# EAGLE design Usb breakout (EAGLE 6.6.0)
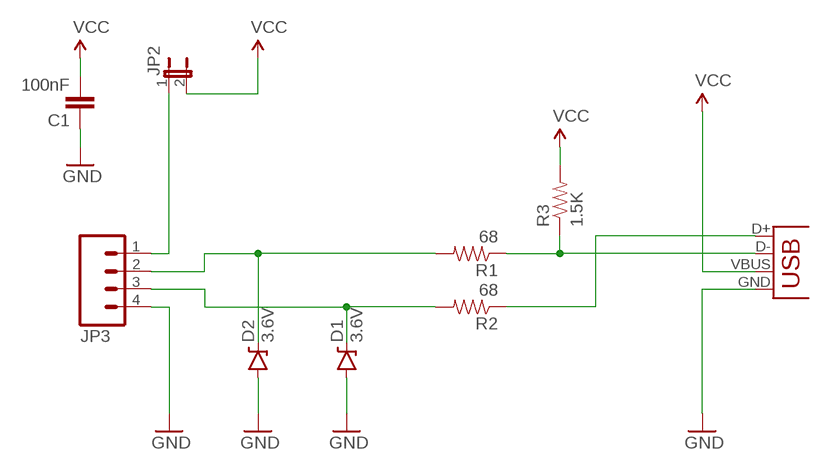
[diagram p0: schematic, sheet 1]

## Parts
C1  100nF  CAPEZ  [CAP-PTH-SMALLEZ]
D1  3.6V  DIODE-ZENERPTH  [DIODE-ZENER]
D2  3.6V  DIODE-ZENERPTH  [DIODE-ZENER]
JP1  USB-B  USBPTH  [USB-B-PTH]
JP2  JUMPER-2-OLDPTH  [1X02]
JP3  M04PTH  [1X04]
R1  68  RESISTORPTH-1/4W  [AXIAL-0.4]
R2  68  RESISTORPTH-1/4W  [AXIAL-0.4]
R3  1.5K  RESISTORPTH-1/4W  [AXIAL-0.4]

## Nets
GND: C1.1 D1.P$2(A) D2.P$2(A) JP1.GND JP3.4
N$1: JP1.D- R1.P$1 R3.P$1
N$2: D2.P$1(C) JP3.2 R1.P$2
N$3: D1.P$1(C) JP3.3 R2.P$2
N$4: JP1.D+ R2.P$1
N$5: JP2.1 JP3.1
VCC: C1.2 JP1.VBUS JP2.2 R3.P$2

## Library data of the parts
C1 = SparkFun-Passives:CAP: Capacitor Standard 0603 ceramic capacitor, and 0.1" leaded capacitor.
D1 D2 = SparkFun-DiscreteSemi:DIODE-ZENER: Zener Diode Production Part - 8199 3.4V Zener Voltage
JP1 = SparkFun-Connectors:USB: USB Connectors USB-B-PTH is fully proven SKU : PRT-00139/CONN-08278 USB-miniB is fully proven SKU : PRT-00587 USB-A-PCB is untested. USB-A-H is throughly reviewed, but untested. Spark Fun Electronics SKU : PRT-00437 USB-B-SMT is throughly reviewed, but untested. Needs silkscreen touching up. USB-A-S has not been used/tested USB-MB-H has not been used/tested USB-MICROB has been used. CONN-09505; PROD_ID: CONN-08278
JP2 = SparkFun-Retired:JUMPER-2-OLD: Jumper Basic 0.1" spaced jumper. Use with breakaway headers.
JP3 = SparkFun-Connectors:M04: Header 4 Standard 4-pin 0.1" header. Use with straight break away headers (SKU : PRT-00116), right angle break away headers (PRT-00553), swiss pins (PRT-00743), machine pins (PRT-00117), and female headers (PRT-00115). Molex polarized connector foot print use with SKU : PRT-08231 with associated crimp pins and housings. 1MM SMD Version SKU: PRT-10208
R1-R3 = SparkFun-Passives:RESISTOR: Resistor Basic schematic elements and footprints for 0603, 1206, and PTH resistors.

## Board
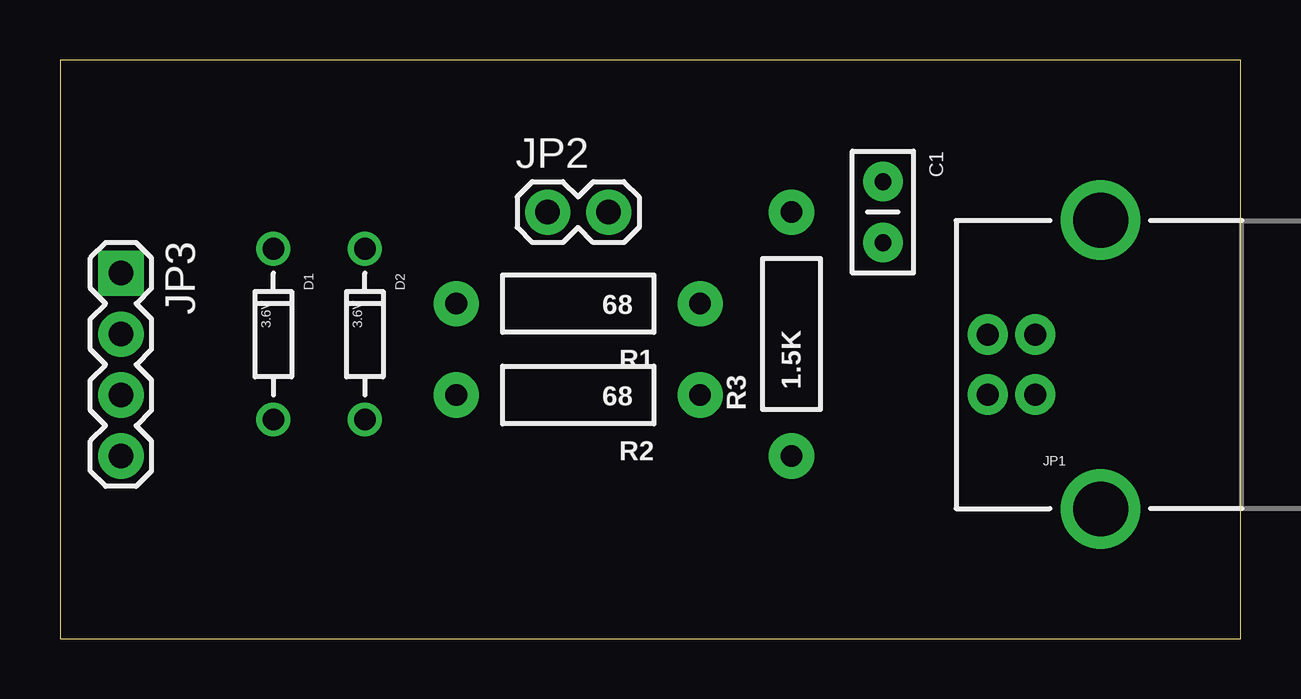
[diagram p1: board, top side]
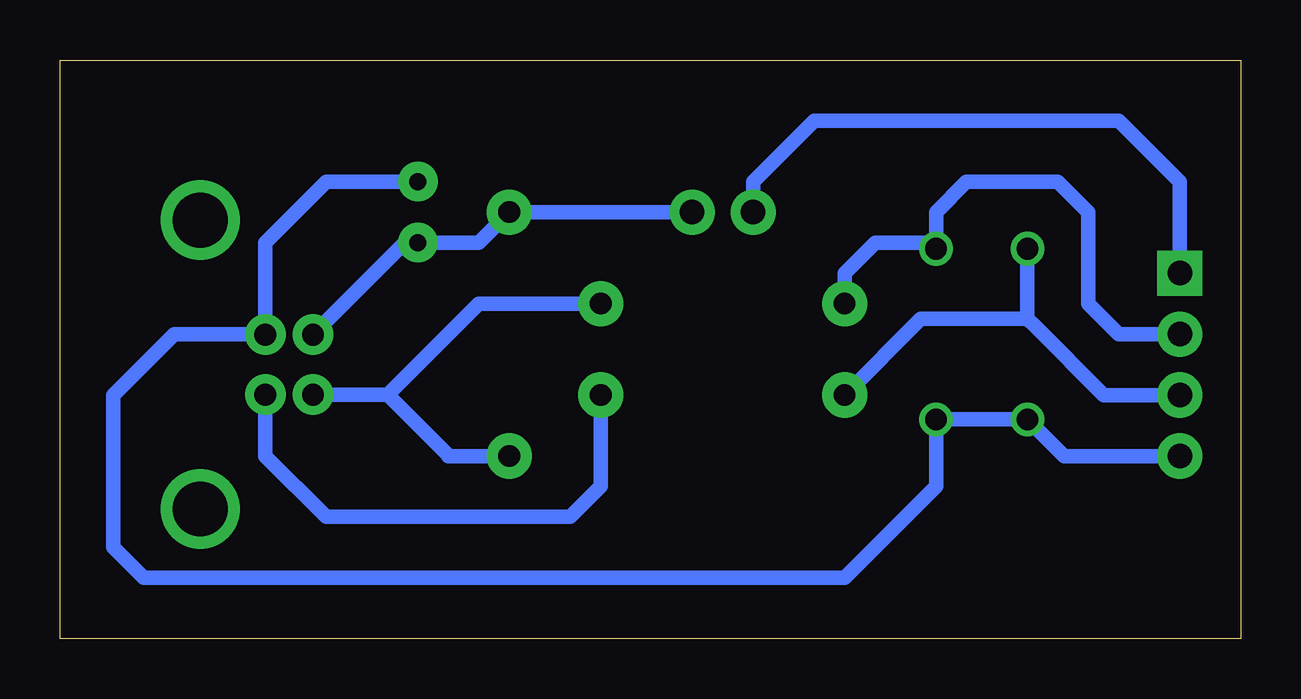
[diagram p2: board, bottom side, seen from below]

Size 49.2 x 24.12 mm. Coordinates in mm from the lower left corner, seen from the top.
Outline: 0,0 49.2,0 49.2,24.12 0,24.12 0,0
Copper layers (1*16): Top 0.035mm / dielectric 1.5mm / Bottom 0.035mm
Design rules "default": minimum track width 10mil, minimum drill 24mil, track to track 8mil, track to pad 8mil, pad to pad 8mil, via to via 8mil, smd to smd 8mil, copper to edge 40mil, drill to drill 8mil, minimum pad ring 10mil, minimum via ring 8mil, stop-mask expansion 4mil, vias tented up to drill 0mil, thermal gap 10mil

### Footprints (pad centres in the part's own frame; a part is rotated, then mirrored left to right if it is on the bottom)
CAP-PTH-SMALLEZ = drill 0.7 pad 1.651: 1 0,0; 2 2.54,0
DIODE-ZENER = drill 0.9: P$1 -3.556,0; P$2 3.556,0
USB-B-PTH = drill 0.914 pad 1.676: D+ 0,1.25; D- 1.981,1.25; GND 0,-1.25; VBUS 1.981,-1.25 | drill 2.286: S1 -2.718,-6.02; S2 -2.718,6.02
1X02 = drill 1.016 pad 1.88: 1 0,0; 2 2.54,0
1X04 = drill 1.016 pad 1.88 square: 1 0,0 | drill 1.016 pad 1.88: 2 2.54,0; 3 5.08,0; 4 7.62,0
AXIAL-0.4 = drill 0.9 pad 1.88: P$1 -5.08,0; P$2 5.08,0

### Placement (x,y rotation side)
C1  34.29,19.05 270 top
D1  8.89,12.7 270 top
D2  12.7,12.7 270 top
JP1  40.64,11.43 180 top
JP2  20.32,17.78 0 top
JP3  2.54,15.24 270 top
R1  21.59,13.97 180 top
R2  21.59,10.16 180 top
R3  30.48,12.7 90 top

### Tracks (layer width: path | path; a pad name or v marks a point on that pad's centre or on a via)
GND
  Bottom 0.61: JP3.4 7.37,7.62 D1.P$2 D2.P$2 12.7,6.35 16.51,2.54 45.72,2.54 46.99,3.81 46.99,10.16 44.45,12.7 40.66,12.7 JP1.GND 40.64,16.51 38.1,19.05 C1.1
N$1
  Bottom 0.61: JP1.D- 35.54,10.18 | 35.54,10.18 31.75,13.97 R1.P$1 | R3.P$1 33.02,7.62 33.02,7.66 35.54,10.18
N$2
  Bottom 0.61: JP3.2 5.08,12.7 6.35,13.97 6.35,17.78 7.62,19.05 11.43,19.05 12.7,17.78 D2.P$1 12.95,16.51 15.24,16.51 16.51,15.24 R1.P$2
N$3
  Bottom 0.61: JP3.3 5.72,10.16 8.57,13.02 8.89,13.34 | 8.89,13.34 D1.P$1 | R2.P$2 13.34,13.34 8.89,13.34
N$4
  Bottom 0.61: R2.P$1 26.67,6.35 27.94,5.08 38.1,5.08 40.64,7.62 JP1.D+
N$5
  Bottom 0.61: JP3.1 2.54,19.05 5.08,21.59 17.78,21.59 20.32,19.05 JP2.1
VCC
  Bottom 0.61: JP2.2 R3.P$2 31.75,16.51 C1.2 34.83,16.51 JP1.VBUS